# EasyEDA schematic SCH_gps-tracker_2023-06-04.json
TITLE: GPS_Tracker; REV: 1.0; Date: 2023-06-04; Sheet: 1/1; Drawn By: Oumaima SLEMA; Company: MakerLab
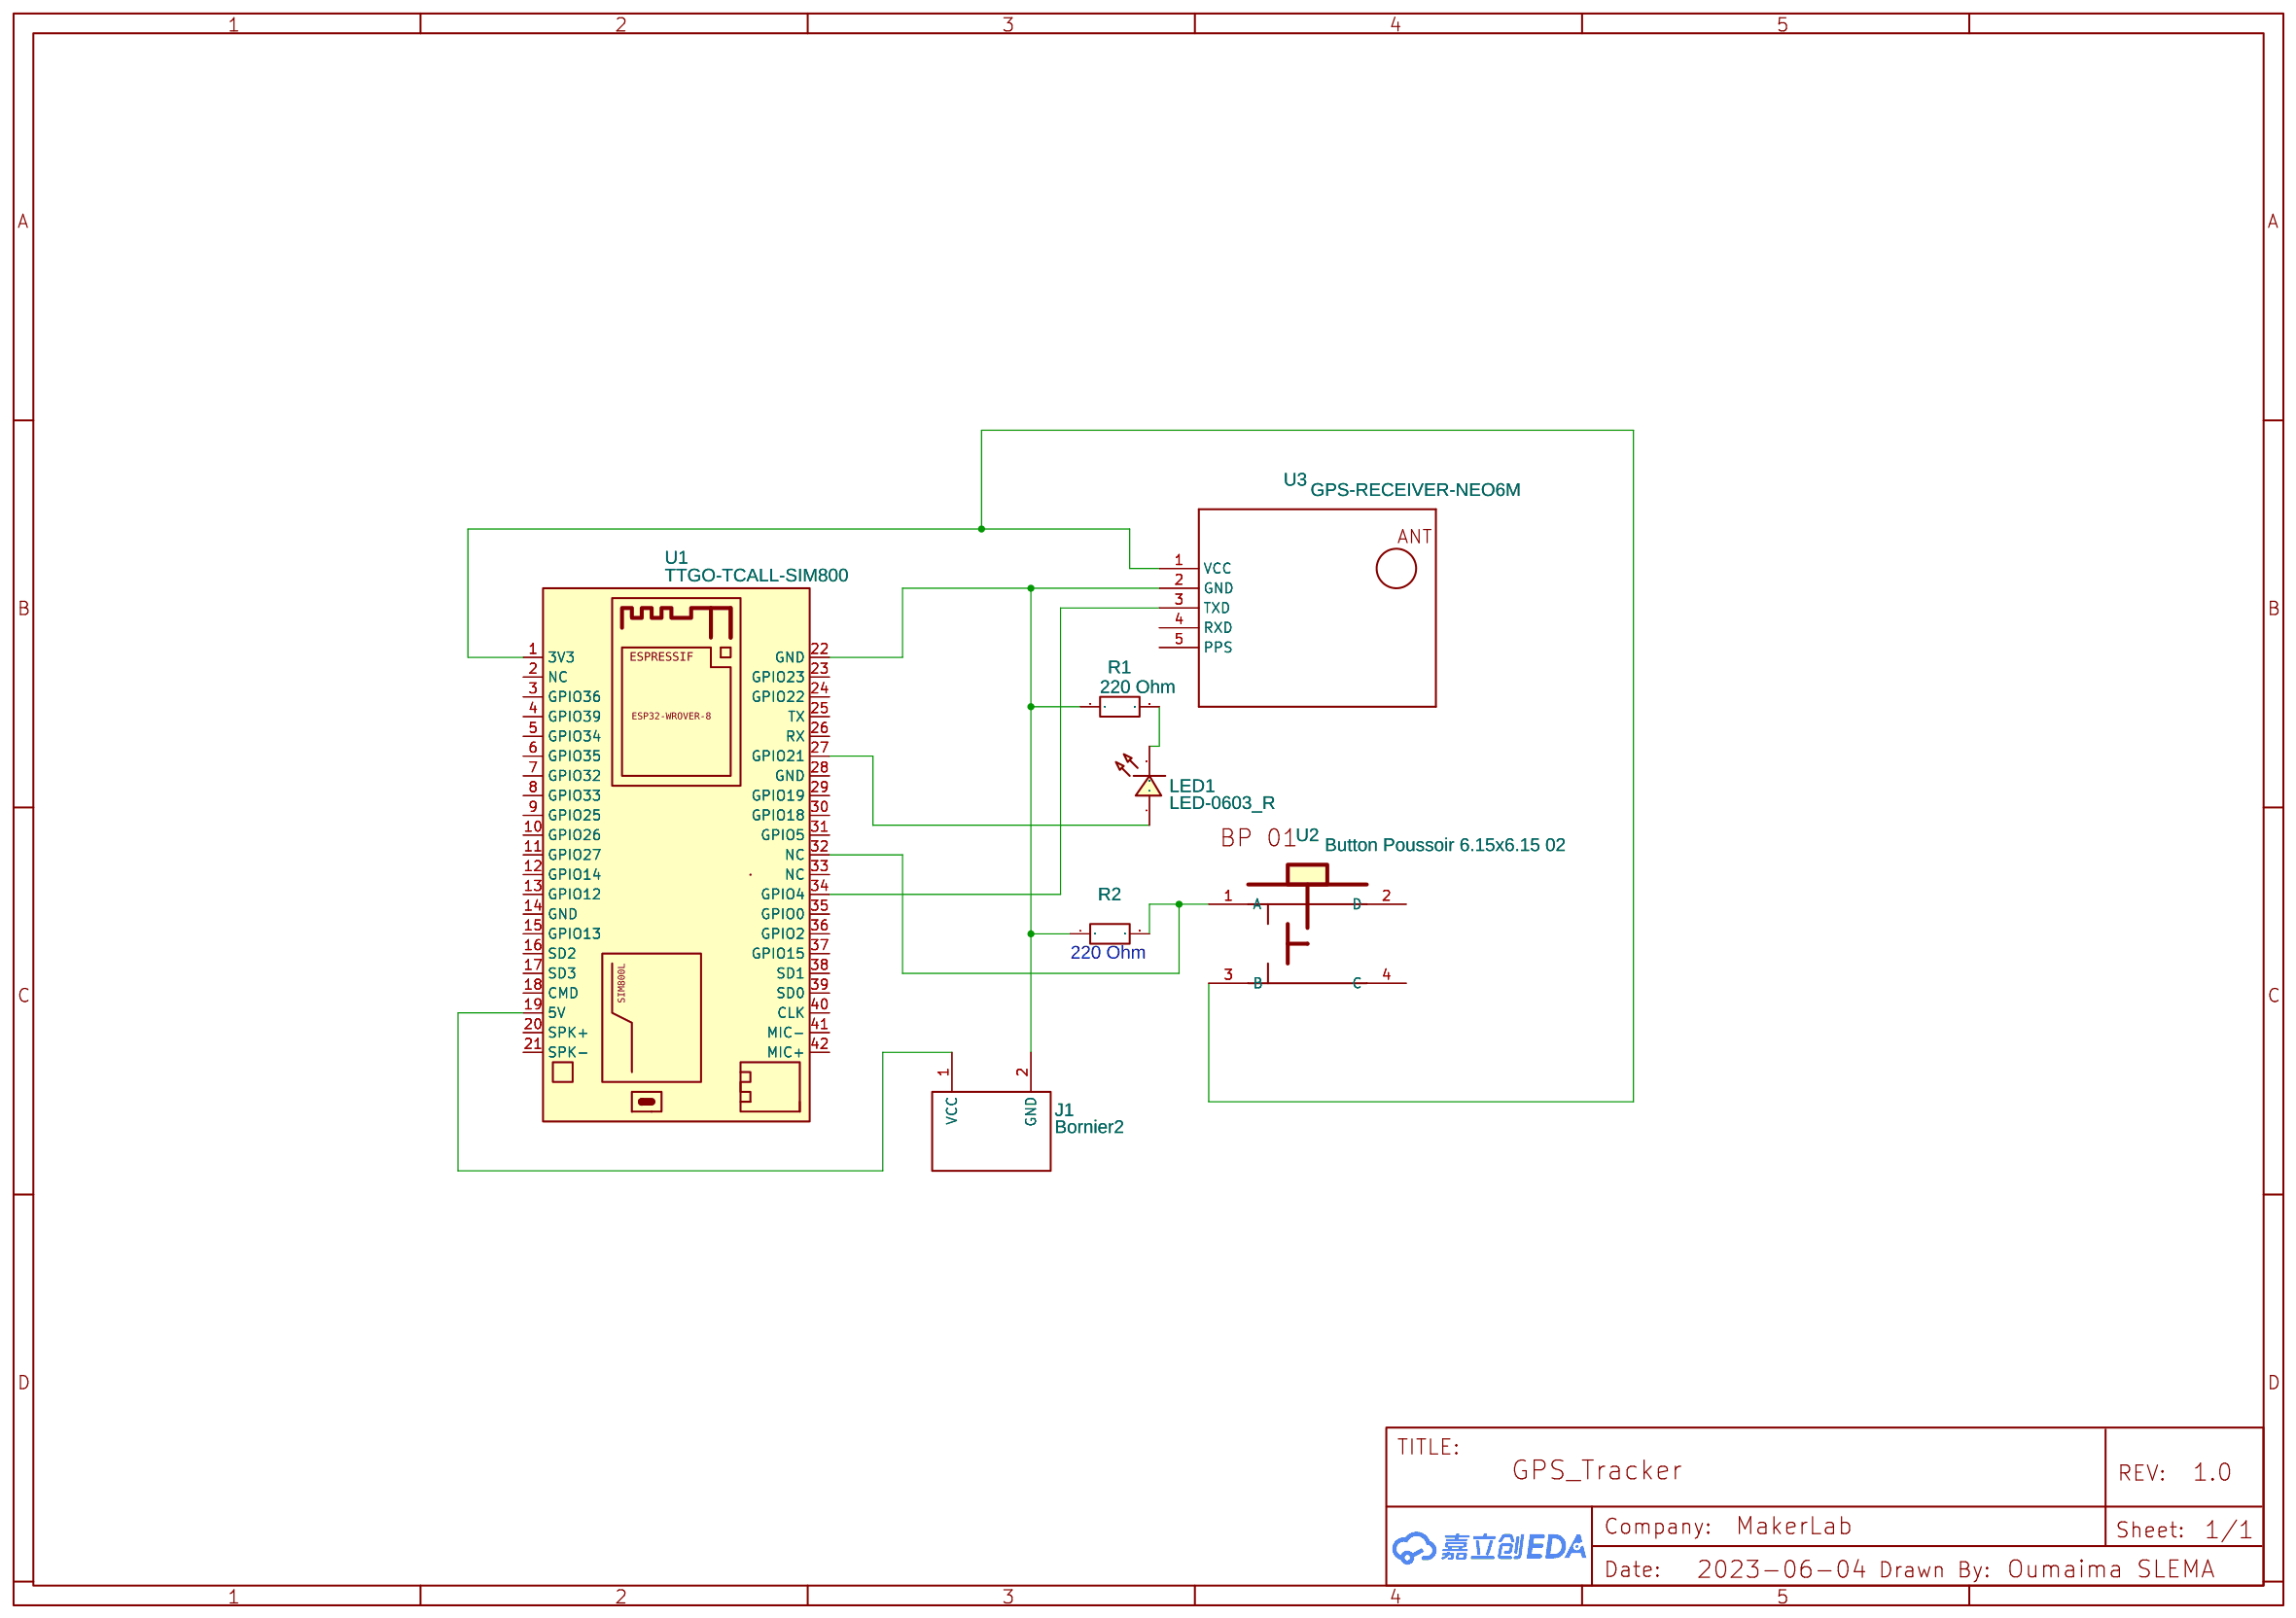
[diagram p0: schematic sheet]

## Parts
J1  Bornier2  [BORNIER2]
LED1  LED-0603_R  [LED0603_RED]
R1  220 Ohm  [R0603]
R2  1k  [R0603]
U1  TTGO-TCALL-SIM800  [TTGO-TCALL-SIM800]
U2  Button Poussoir 6.15x6.15 02  [BOUTTON POUSSOIR FOOTPRINT]
U3  GPS-RECEIVER-NEO6M  [GPS-RECEIVER-NEO6M]

## Library data of the parts
J1 = Bornier2: Contributor: salydu29; sourceId: 5y8IiSrpn
LED1 = LED-0603_R: Manufacturer: EVERLIGHT(台湾亿光); Manufacturer Part: 19-217/R6C-AL1M2VY/3T; Supplier Part: C72044; Supplier: LCSC; Contributor: LCEDA_01
R1 R2 = R_0603_EU: Contributor: LCEDA_Lib
U1 = TTGO-TCALL-SIM800: Contributor: rommelts coyo
U2 = Button Poussoir 6.15x6.15 02: Contributor: Chr2021
U3 = GPS-RECEIVER-NEO6M: GPS Receiver Module based on NEO-6 device

## Nets
Net-(J1-1): J1.1(VCC) U1.19(5V)
Net-(J1-2): J1.2(GND) R1.1 R2.1 U1.22(GND) U3.2(GND)
Net-(LED1-1): LED1.1 U1.27(GPIO21)
Net-(LED1-2): LED1.2 R1.2
Net-(R2-2): R2.2 U1.32(NC) U2.1(A)
Net-(U1-1): U1.1(3V3) U2.3(B) U3.1(VCC)
Net-(U1-34): U1.34(GPIO4) U3.3(TXD)

Not connected (* = marked no-connect by the designer): U1 2(NC) 3(GPIO36) 4(GPIO39) 5(GPIO34) 6(GPIO35) 7(GPIO32) 8(GPIO33) 9(GPIO25) 10(GPIO26) 11(GPIO27) 12(GPIO14) 13(GPIO12) 14(GND) 15(GPIO13) 16(SD2) 17(SD3) 18(CMD) 20(SPK+) 21(SPK-) 23(GPIO23) 24(GPIO22) 25(TX) 26(RX) 28(GND) 29(GPIO19) 30(GPIO18) 31(GPIO5) 33(NC) 35(GPIO0) 36(GPIO2) 37(GPIO15) 38(SD1) 39(SD0) 40(CLK) 41(MIC-) 42(MIC+); U2 2(D) 4(C); U3 4(RXD) 5(PPS)

## Notes on the sheet
- 220 Ohm
